# Altium schematic sheet MCU.SchDoc
size A3; Date: 2015/11/20; CompanyName: 成都淞幸科技有限责任公司; DrawnBy: 冯光荣; Engineer: 冯光荣; Organization: 系统集成部; Address1: 四川省成都市西航港街道珠江路; Address2: 空港国际城7栋1单元11层; DocumentNumber: SX-ZNJJ-02; Revision: v3.1; SheetNumber: 1; SheetTotal: 6; Telphone: 028-6445 2893; Fax: 028-8580 5757; Website: www.sunsheen.cn; DocumentName: DocumentName; ProjectName: ProjectName
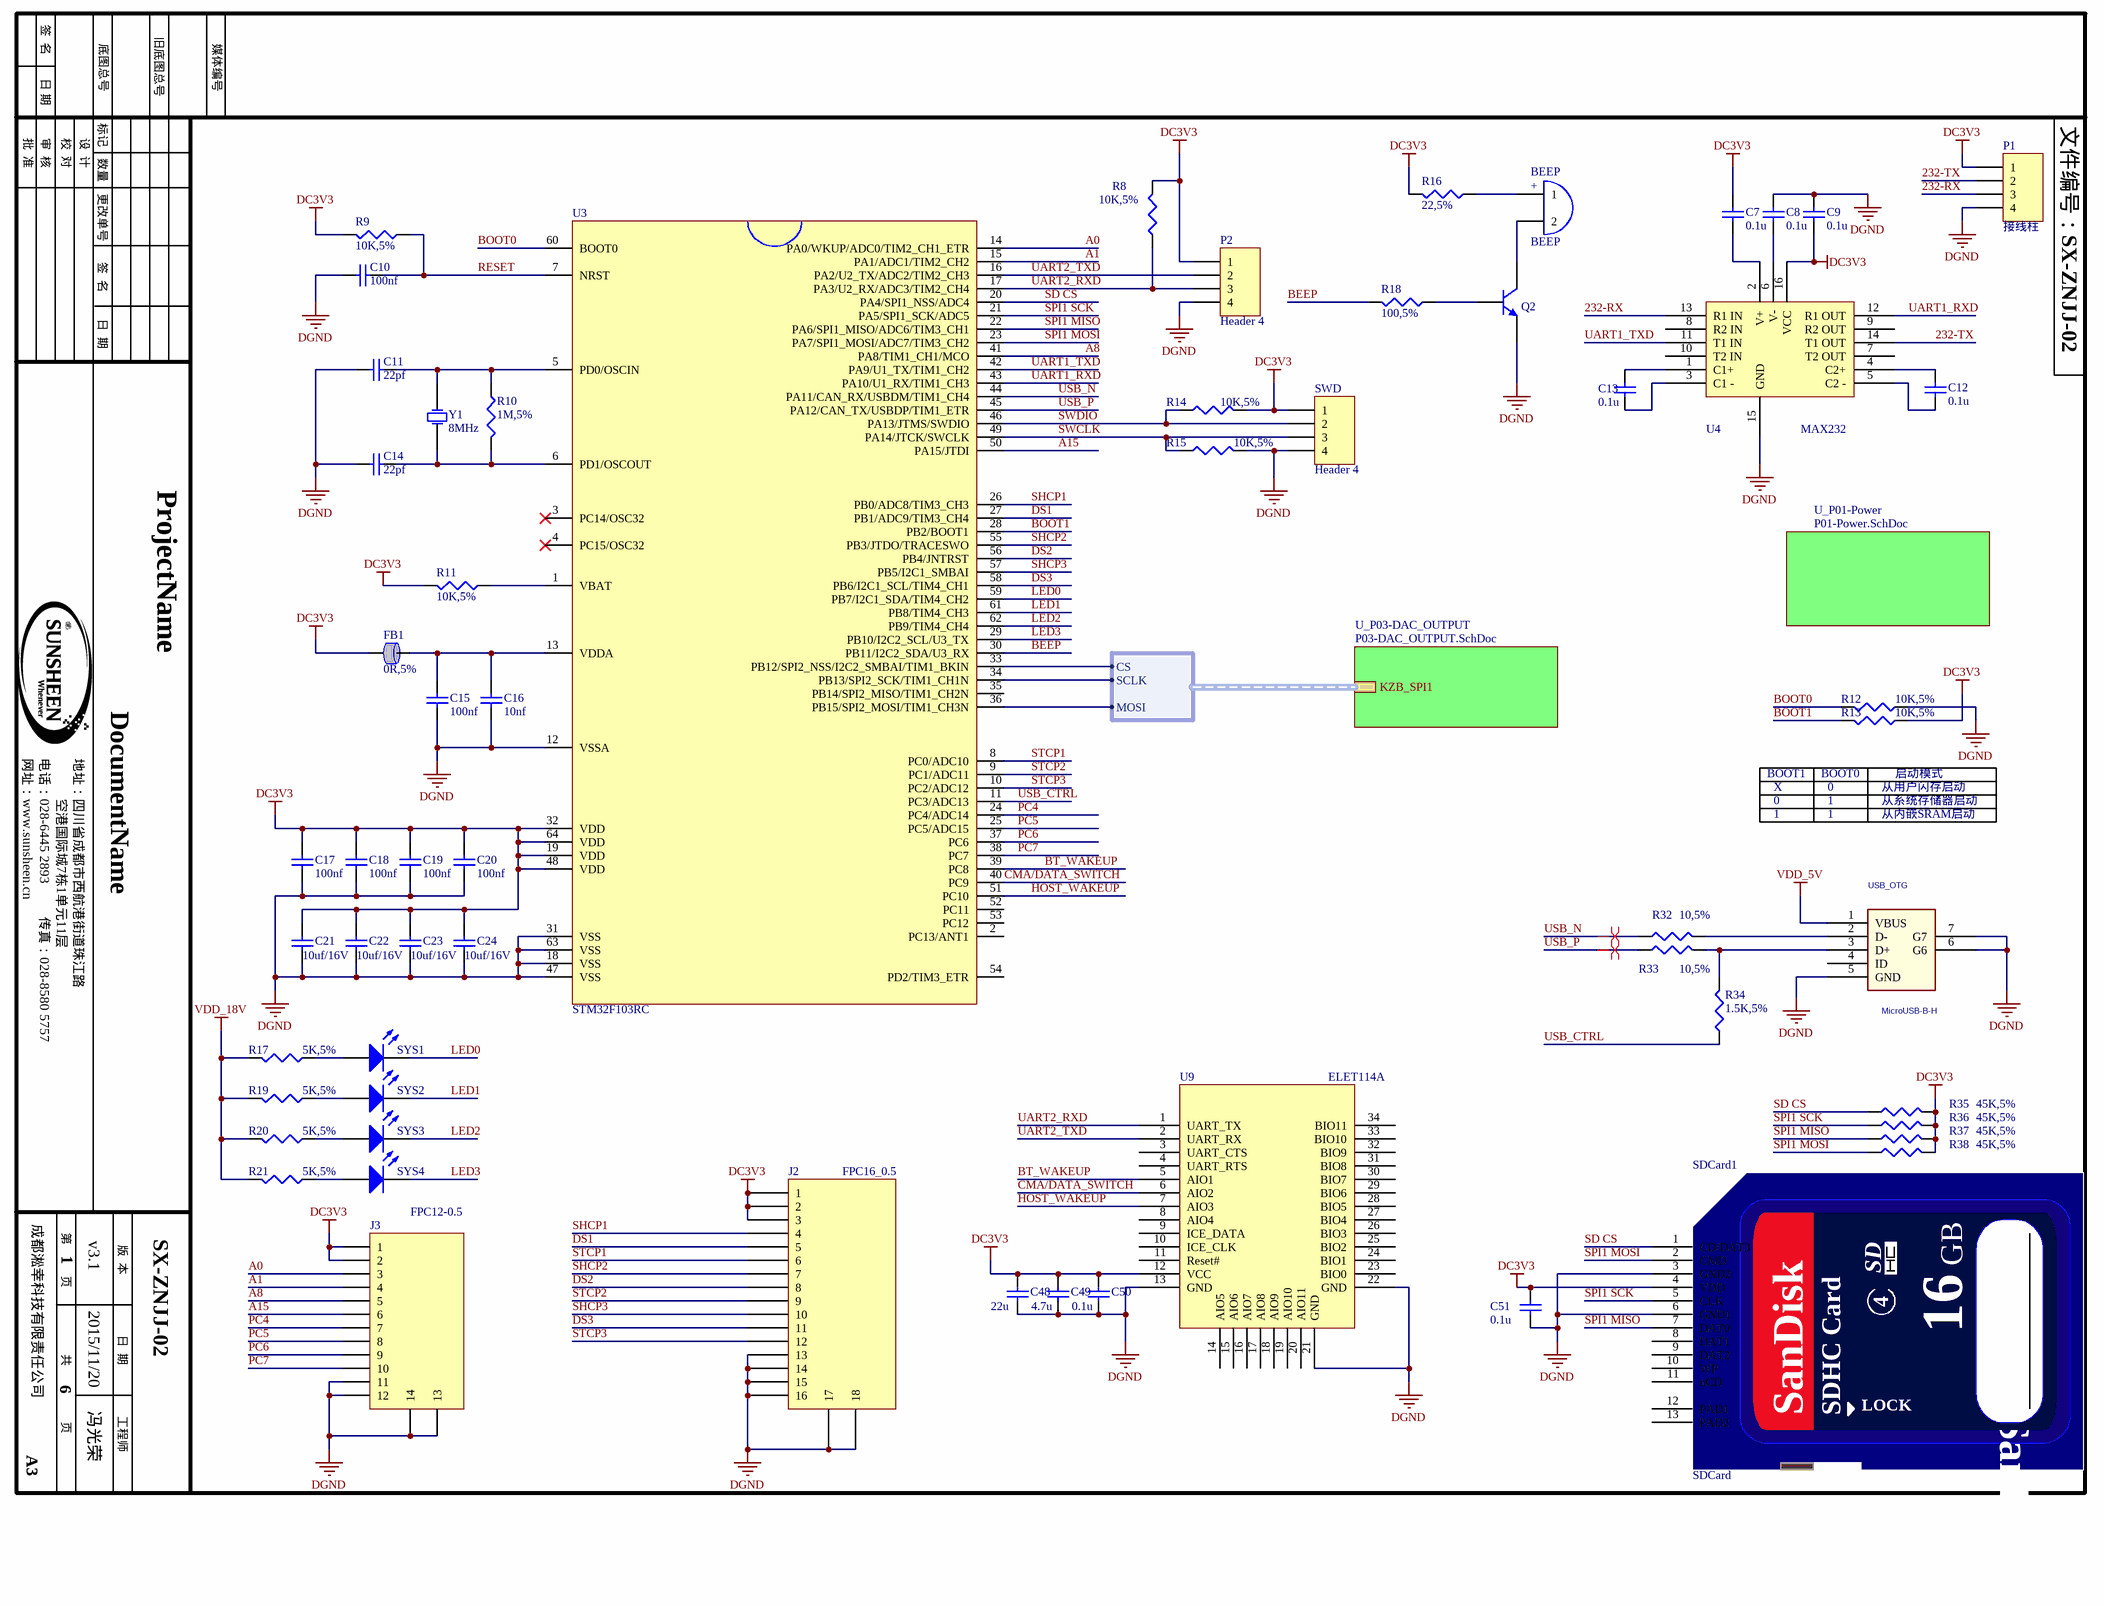
[diagram p0: MCU.SchDoc]

## Parts
BEEP  BEEP  [蜂鸣器]
C7  0.1u  [Cap0603]
C8  0.1u  [Cap0603]
C9  0.1u  [Cap0603]
C10  100nf  [Cap0603]
C11  22pf  [Cap0603]
C12  0.1u  [Cap0603]
C13  0.1u  [Cap0603]
C14  22pf  [Cap0603]
C15  100nf  [Cap0603]
C16  10nf  [Cap0603]
C17  100nf  [Cap0603]
C18  100nf  [Cap0603]
C19  100nf  [Cap0603]
C20  100nf  [Cap0603]
C21  10uf/16V  [Cap0603]
C22  10uf/16V  [Cap0603]
C23  10uf/16V  [Cap0603]
C24  10uf/16V  [Cap0603]
C48  22u  [Cap0603]
C49  4.7u  [Cap0603]
C50  0.1u  [Cap0603]
C51  0.1u  [Cap0603]
FB1  0R,5%  [FB0603]
J2  FPC16_0.5  [FPC0.5-16P]
J3  FPC12-0.5  [FPC0.5-12P]
P1  接线柱  [4P接线柱5.08mm]
P2  Header 4  [HDR1X4]
Q2  S8050  [SOT-23B]  (value not drawn)
R8  10K,5%  [Res0603]
R9  10K,5%  [Res0603]
R10  1M,5%  [Res0603]
R11  10K,5%  [Res0603]
R12  10K,5%  [Res0603]
R13  10K,5%  [Res0603]
R14  10K,5%  [Res0603]
R15  10K,5%  [Res0603]
R16  22,5%  [Res0603]
R17  5K,5%  [Res0603]
R18  100,5%  [Res0603]
R19  5K,5%  [Res0603]
R20  5K,5%  [Res0603]
R21  5K,5%  [Res0603]
R32  10,5%  [Res0603]
R33  10,5%  [Res0603]
R34  1.5K,5%  [Res0603]
R35  45K,5%  [Res0603]
R36  45K,5%  [Res0603]
R37  45K,5%  [Res0603]
R38  45K,5%  [Res0603]
SDCard1  SDCard  [SDCard]
SWD  Header 4  [HDR1X4]
SYS1  RED  [坐式LED]  (value not drawn)
SYS2  RED  [坐式LED]  (value not drawn)
SYS3  RED  [坐式LED]  (value not drawn)
SYS4  RED  [坐式LED]  (value not drawn)
U3  STM32F103RC  [QFP50P1200X1200X160-64N]
U4  MAX232  [SO-16]
U9  ELET114A  [ELET114A]
USB_OTG  MicroUSB-B-H  [MICROUSB-B-H]
Y1  8MHz  [XTAL_49SMD]

## Sub-sheets
U_P01-Power = P01-Power.SchDoc: no entries
U_P03-DAC_OUTPUT = P03-DAC_OUTPUT.SchDoc: KZB_SPI1 (harness KZB_SPI1)

## Harnesses
KZB_SPI1: CS, SCLK, MOSI

## Nets
DC3V3: C7.2 C9.1 C17.2 C18.2 C19.2 C20.2 C21.2 C22.2 C23.2 C24.2 C48.2 C49.2 C50.2 C51.1 FB1.1 J2.1 J2.2 J2.3 J3.1 J3.2 P1.1 P2.1 R8.2 R9.2 R11.2 R13.1 R14.2 R16.2 R35.2 R36.2 R37.2 R38.2 SDCard1.4(VDD) SWD.1 U3.19(VDD) U3.32(VDD) U3.48(VDD) U3.64(VDD) U4.16(VCC) U9.12(VCC)
DGND: C8.2 C9.2 C10.1 C11.1 C14.1 C15.1 C16.1 C17.1 C18.1 C19.1 C20.1 C21.1 C22.1 C23.1 C24.1 C48.1 C49.1 C50.1 C51.2 J2.13 J2.14 J2.15 J2.16 J2.17 J2.18 J3.11 J3.12 J3.13 J3.14 P1.4 P2.4 Q2.2(E) R12.1 R15.2 SDCard1.3(GND2) SDCard1.6(GND1) SWD.4 U3.12(VSSA) U3.18(VSS) U3.31(VSS) U3.47(VSS) U3.63(VSS) U4.15(GND) U9.13(GND) U9.21(GND) U9.22(GND) USB_OTG.5(GND) USB_OTG.6(G6) USB_OTG.7(G7)
VDD_5V: USB_OTG.1(VBUS)
VDD_18V: R17.1 R19.1 R20.1 R21.1
232-RX: P1.3 U4.13(R1_IN)
232-TX: P1.2 U4.14(T1_OUT)
A0: J3.3 U3.14(PA0/WKUP/ADC0/TIM2_CH1_ETR)
A1: J3.4 U3.15(PA1/ADC1/TIM2_CH2)
A8: J3.5 U3.41(PA8/TIM1_CH1/MCO)
A15: J3.6 U3.50(PA15/JTDI)
BEEP: R18.2 U3.30(PB11/I2C2_SDA/U3_RX)
BOOT0: R12.2 U3.60(BOOT0)
BOOT1: R13.2 U3.28(PB2/BOOT1)
BT_WAKEUP: U3.39(PC8) U9.5(AIO1)
CMA/DATA_SWITCH: U3.40(PC9) U9.6(AIO2)
DS1: J2.5 U3.27(PB1/ADC9/TIM3_CH4)
DS2: J2.8 U3.56(PB4/JNTRST)
DS3: J2.11 U3.58(PB6/I2C1_SCL/TIM4_CH1)
HOST_WAKEUP: U3.51(PC10) U9.7(AIO3)
LED0: SYS1.K U3.59(PB7/I2C1_SDA/TIM4_CH2)
LED1: SYS2.K U3.61(PB8/TIM4_CH3)
LED2: SYS3.K U3.62(PB9/TIM4_CH4)
LED3: SYS4.K U3.29(PB10/I2C2_SCL/U3_TX)
PC4: J3.7 U3.24(PC4/ADC14)
PC5: J3.8 U3.25(PC5/ADC15)
PC6: J3.9 U3.37(PC6)
PC7: J3.10 U3.38(PC7)
RESET: C10.2 R9.1 U3.7(NRST)
SD CS: R35.1 SDCard1.1(CD/DAT3) U3.20(PA4/SPI1_NSS/ADC4)
SHCP1: J2.4 U3.26(PB0/ADC8/TIM3_CH3)
SHCP2: J2.7 U3.55(PB3/JTDO/TRACESWO)
SHCP3: J2.10 U3.57(PB5/I2C1_SMBAI)
SPI1 MISO: R37.1 SDCard1.7(DAT0) U3.22(PA6/SPI1_MISO/ADC6/TIM3_CH1)
SPI1 MOSI: R38.1 SDCard1.2(CMD) U3.23(PA7/SPI1_MOSI/ADC7/TIM3_CH2)
SPI1 SCK: R36.1 SDCard1.5(CLK) U3.21(PA5/SPI1_SCK/ADC5)
STCP1: J2.6 U3.8(PC0/ADC10)
STCP2: J2.9 U3.9(PC1/ADC11)
STCP3: J2.12 U3.10(PC2/ADC12)
SWCLK: R15.1 SWD.3 U3.49(PA14/JTCK/SWCLK)
SWDIO: R14.1 SWD.2 U3.46(PA13/JTMS/SWDIO)
UART1_RXD: U3.43(PA10/U1_RX/TIM1_CH3) U4.12(R1_OUT)
UART1_TXD: U3.42(PA9/U1_TX/TIM1_CH2) U4.11(T1_IN)
UART2_RXD: P2.3 R8.1 U3.17(PA3/U2_RX/ADC3/TIM2_CH4) U9.1(UART_TX)
UART2_TXD: P2.2 U3.16(PA2/U2_TX/ADC2/TIM2_CH3) U9.2(UART_RX)
USB_CTRL: R34.1 U3.11(PC3/ADC13)
USB_N: R32.1 U3.44(PA11/CAN_RX/USBDM/TIM1_CH4)
USB_P: R33.1 U3.45(PA12/CAN_TX/USBDP/TIM1_ETR)
NetBEEP_1: BEEP.1 R16.1
NetBEEP_2: BEEP.2 Q2.3(C)
NetC7_1: C7.1 U4.2(V+)
NetC8_1: C8.1 U4.6(V-)
NetC11_2: C11.2 R10.1 U3.5(PD0/OSCIN) Y1.1(OSC1)
NetC12_1: C12.1 U4.5(C2_-)
NetC12_2: C12.2 U4.4(C2+)
NetC13_1: C13.1 U4.3(C1_-)
NetC13_2: C13.2 U4.1(C1+)
NetC14_2: C14.2 R10.2 U3.6(PD1/OSCOUT) Y1.2(OSC2)
NetC15_2: C15.2 C16.2 FB1.2 U3.13(VDDA)
NetQ2_1: Q2.1(B) R18.1
NetR11_1: R11.1 U3.1(VBAT)
NetR17_2: R17.2 SYS1.A
NetR19_2: R19.2 SYS2.A
NetR20_2: R20.2 SYS3.A
NetR21_2: R21.2 SYS4.A
NetR32_2: R32.2 USB_OTG.2(D-)
NetR33_2: R33.2 R34.2 USB_OTG.3(D+)
NetU3_33: U3.33(PB12/SPI2_NSS/I2C2_SMBAI/TIM1_BKIN) ; sheet U_P03-DAC_OUTPUT/KZB_SPI1.CS
NetU3_34: U3.34(PB13/SPI2_SCK/TIM1_CH1N) ; sheet U_P03-DAC_OUTPUT/KZB_SPI1.SCLK
NetU3_36: U3.36(PB15/SPI2_MOSI/TIM1_CH3N) ; sheet U_P03-DAC_OUTPUT/KZB_SPI1.MOSI

Not connected (* = marked no-connect by the designer): SDCard1 8(DAT1) 9(DAT2) 10(WP) 11(nCD) 12(PAD1) 13(PAD2); U3 2(PC13/ANT1) 3(PC14/OSC32)* 4(PC15/OSC32)* 35(PB14/SPI2_MISO/TIM1_CH2N) 52(PC11) 53(PC12) 54(PD2/TIM3_ETR); U4 7(T2_OUT) 8(R2_IN) 9(R2_OUT) 10(T2_IN); U9 3(UART_CTS) 4(UART_RTS) 8(AIO4) 9(ICE_DATA) 10(ICE_CLK) 11(Reset#) 14(AIO5) 15(AIO6) 16(AIO7) 17(AIO8) 18(AIO9) 19(AIO10) 20(AIO11) 23(BIO0) 24(BIO1) 25(BIO2) 26(BIO3) 27(BIO4) 28(BIO5) 29(BIO6) 30(BIO7) 31(BIO8) 32(BIO9) 33(BIO10) 34(BIO11); USB_OTG 4(ID)

## Layout directives
differential pair: USB_N, USB_P

## Notes on the sheet
- BOOT1
- BOOT0
- 启动模式
- X
- 0
- 1
- 从用户闪存启动
- 从系统存储器启动
- 从内嵌SRAM启动
- 签  名
- 底图总号
- 旧底图总号
- 媒体编号
- 日 期
- 批  准
- 审  核
- 校  对
- 设  计
- 标记
- 数量
- 文件编号：
- 更改单号
- 日  期
- 网址：
- 电话：
- 地址：
- 传真：
- 第
- 版  本
- 页
- 共
- A3
- 工程师
- (in symbol BELL) +
- (in symbol SDCard) GB; SD; 16; SanDisk; SDHC Card; LOCK

## Library data of the parts
BEEP = BELL
C7-C24 C48-C51 = Cap Semi: 无极性电容（表贴）
FB1 = FerriteBead: 磁珠
P1 P2 SWD = Header 4: Header, 4-Pin
  SWD: LatestRevisionDate: 17-Jul-2002; LatestRevisionNote: Re-released for DXP Platform.; Publisher: Altium Limited
Q2 = S8050: NPN
R8-R21 R32-R38 = Res: 电阻
SDCard1 = SDCard: SDCard插座
SYS1-SYS4 = LED: Typical RED, GREEN, YELLOW, AMBER GaAs LED
U4 = MAX232AEWE(16): +-15KV ESD-PROTECTED, +5V RS-232 TRANSCEIVERS
USB_OTG = MicroUSB-B-H: 手机接口型USB
Y1 = XTAL: 晶体振荡器